# Altium schematic sheet CarrierBoard_TopSheet.SchDoc
size A4; CompanyName: Technische Hochschule Nürnberg Georg Simon Ohm; Organization: UltraZohm; Address1: Kesslerplatz 12; Address2: 90489 Nürnberg; Address3: GERMANY; SheetNumber: 1; Website: www.ultrazohm.com
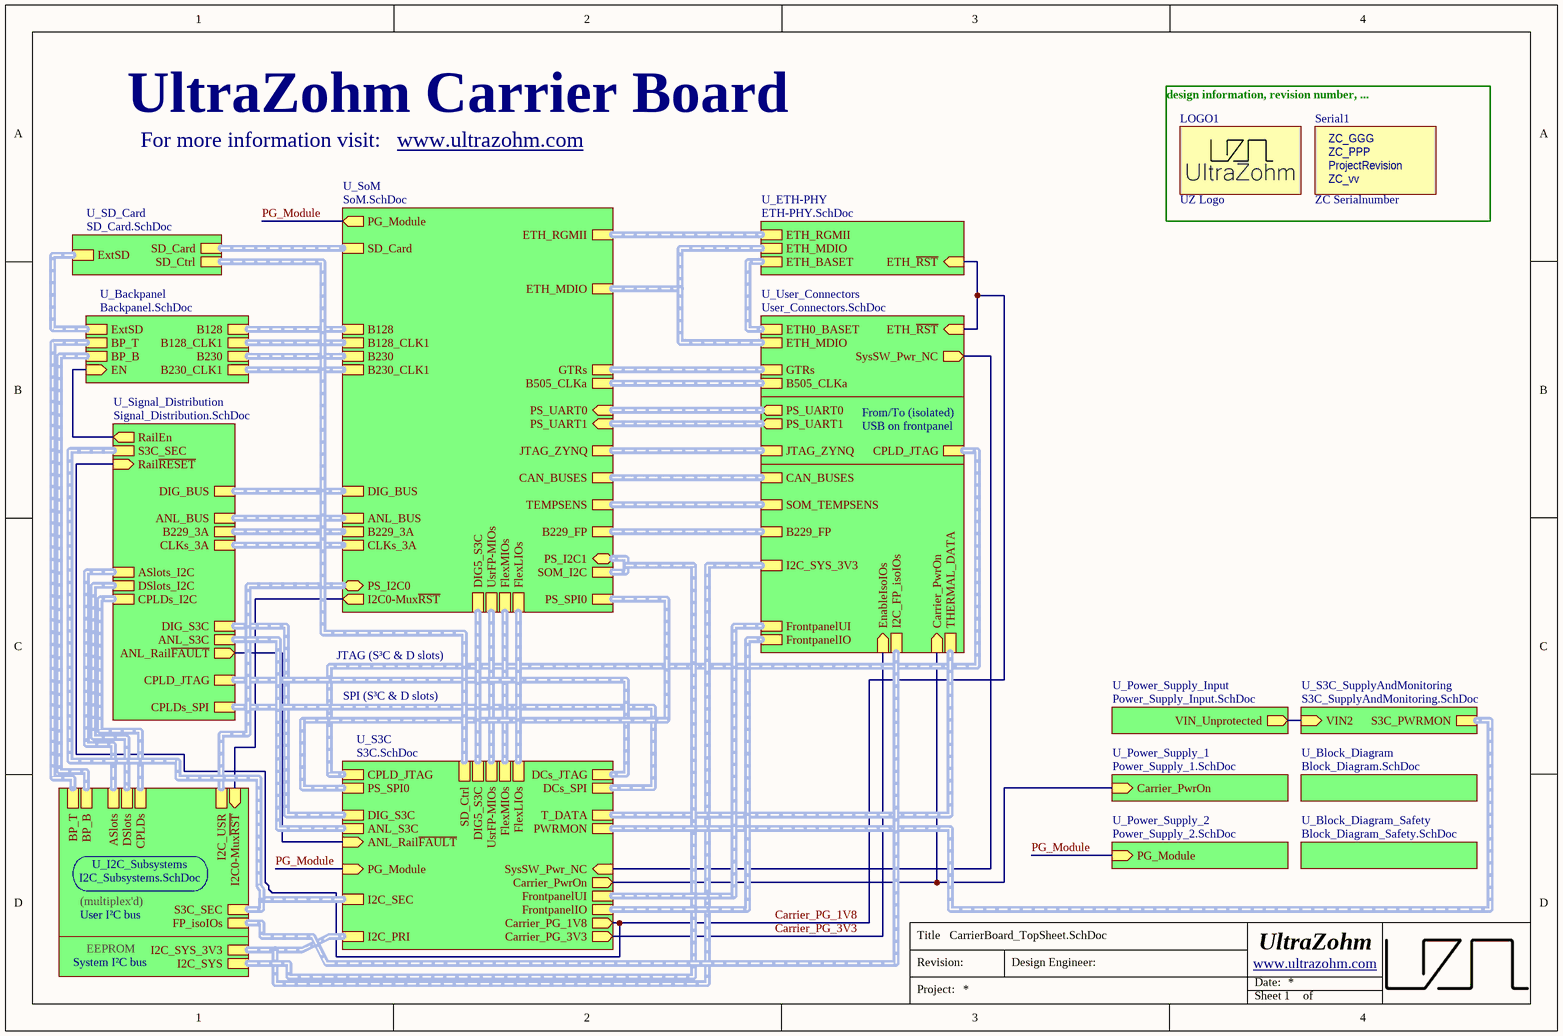
[diagram p0: CarrierBoard_TopSheet.SchDoc]

## Parts
LOGO1  UZ Logo  [UZ_Logo_small]  (no BOM)
Serial1  ZC Serialnumber  [ZC-Serial]  (no BOM)

## Sub-sheets
U_Backpanel = Backpanel.SchDoc: B128 (harness MGT4), B128_CLK1 (harness MGTCLK), B230 (harness MGT4), B230_CLK1 (harness MGTCLK), EN (in), BP_T (harness I2C), BP_B (harness I2C), ExtSD (harness ExtSD)
U_Block_Diagram = Block_Diagram.SchDoc: no entries
U_Block_Diagram_Safety = Block_Diagram_Safety.SchDoc: no entries
U_ETH-PHY = ETH-PHY.SchDoc: ETH_RGMII (harness ETH_RGMII), ETH_MDIO (harness ETH_MDIO), ETH_~{RST} (in), ETH_BASET (harness ETH_BASET)
U_I2C_Subsystems = I2C_Subsystems.SchDoc: I2C_USR (harness I2C), I2C_SYS (harness I2C), I2C_SYS_3V3 (harness I2C), CPLDs (harness I2C), DSlots (harness I2C), ASlots (harness I2C), S3C_SEC (harness I2C), FP_isoIOs (harness I2C), I2C0-Mux~{RST} (in), BP_T (harness I2C), BP_B (harness I2C)
U_Power_Supply_1 = Power_Supply_1.SchDoc: Carrier_PwrOn (in)
U_Power_Supply_2 = Power_Supply_2.SchDoc: PG_Module (in)
U_Power_Supply_Input = Power_Supply_Input.SchDoc: VIN_Unprotected (out)
U_S3C = S3C.SchDoc: DIG_S3C (harness DIG_S3C), PWRMON (harness S3C_PWRMON), CPLD_JTAG (harness JTAG), DCs_JTAG (harness JTAG), DCs_SPI (harness SPI_CPLDs), I2C_PRI (harness I2C), I2C_SEC (harness I2C), FrontpanelUI (harness FrontpanelUI), FlexMIOs (harness FlexMIOs), UsrFP-MIOs (harness UsrFP-MIOs), SysSW_Pwr_NC (in), T_DATA (harness T_DATA), ANL_S3C (harness ANL_S3C), SD_Ctrl (harness SD_Ctrl), PG_Module (in), Carrier_PwrOn (out), FrontpanelIO (harness FrontpanelIO), PS_SPI0 (harness SPI), DIG5_S3C (harness DIG5_S3C), FlexLIOs (harness FlexLIOs), Carrier_PG_3V3 (out), Carrier_PG_1V8 (out), ANL_Rail~{FAULT} (in)
U_S3C_SupplyAndMonitoring = S3C_SupplyAndMonitoring.SchDoc: VIN2 (in), S3C_PWRMON (harness S3C_PWRMON)
U_SD_Card = SD_Card.SchDoc: SD_Card (harness SD_Card), SD_Ctrl (harness SD_Ctrl), ExtSD (harness ExtSD)
U_Signal_Distribution = Signal_Distribution.SchDoc: DIG_BUS (harness DIG_BUS), ANL_BUS (harness ANL_BUS), CPLD_JTAG (harness JTAG), DSlots_I2C (harness I2C), ASlots_I2C (harness I2C), CPLDs_I2C (harness I2C), CPLDs_SPI (harness SPI_CPLDs), DIG_S3C (harness DIG_S3C), ANL_S3C (harness ANL_S3C), ANL_Rail~{FAULT} (out), B229_3A (harness MGT3), CLKs_3A (harness CLKs_3A), RailEn (out), Rail~{RESET} (in), S3C_SEC (harness I2C)
U_SoM = SoM.SchDoc: PS_UART1 (in, harness UART), PS_UART0 (in, harness UART), PS_I2C1 (bidir, harness I2C), PS_I2C0 (bidir, harness I2C), PG_Module (out), DIG_BUS (harness DIG_BUS), ETH_RGMII (harness ETH_RGMII), SD_Card (harness SD_Card), ANL_BUS (harness ANL_BUS), GTRs (harness GTRs), ETH_MDIO (harness ETH_MDIO), JTAG_ZYNQ (harness JTAG), PS_SPI0 (harness SPI), CAN_BUSES (harness CAN_BUSES), SOM_I2C (harness I2C), TEMPSENS (harness T_DIODE), UsrFP-MIOs (harness UsrFP-MIOs), FlexMIOs (harness FlexMIOs), B505_CLKa (harness MGTCLK), DIG5_S3C (harness DIG5_S3C), FlexLIOs (harness FlexLIOs), I2C0-Mux~{RST} (out), B229_3A (harness MGT3), CLKs_3A (harness CLKs_3A), B128 (harness MGT4), B128_CLK1 (harness MGTCLK), B230 (harness MGT4), B230_CLK1 (harness MGTCLK), B229_FP (harness GTH)
U_User_Connectors = User_Connectors.SchDoc: PS_UART0 (out, harness UART), PS_UART1 (out, harness UART), JTAG_ZYNQ (harness JTAG), CAN_BUSES (harness CAN_BUSES), CPLD_JTAG (harness JTAG), GTRs (harness GTRs), ETH0_BASET (harness ETH_BASET), ETH_MDIO (harness ETH_MDIO), SOM_TEMPSENS (harness T_DIODE), I2C_SYS_3V3 (harness I2C), FrontpanelUI (harness FrontpanelUI), SysSW_Pwr_NC (out), B505_CLKa (harness MGTCLK), THERMAL_DATA (harness T_DATA), FrontpanelIO (harness FrontpanelIO), ETH_~{RST} (in), EnableIsoIOs (in), I2C_FP_isoIOs (harness I2C), Carrier_PwrOn (in), B229_FP (harness GTH)

## Nets
Carrier_PG_1V8: sheet U_Signal_Distribution/Rail~{RESET}, sheet U_ETH-PHY/ETH_~{RST}, sheet U_User_Connectors/ETH_~{RST}, sheet U_S3C/Carrier_PG_1V8
Carrier_PG_3V3: sheet U_User_Connectors/EnableIsoIOs, sheet U_S3C/Carrier_PG_3V3
PG_Module: sheet U_SoM/PG_Module, sheet U_Power_Supply_2/PG_Module, sheet U_S3C/PG_Module
(unnamed): sheet U_Signal_Distribution/ANL_Rail~{FAULT}, sheet U_S3C/ANL_Rail~{FAULT}
(unnamed): sheet U_Signal_Distribution/RailEn, sheet U_Backpanel/EN
(unnamed): sheet U_SoM/I2C0-Mux~{RST}, sheet U_I2C_Subsystems/I2C0-Mux~{RST}
(unnamed): sheet U_User_Connectors/SysSW_Pwr_NC, sheet U_S3C/SysSW_Pwr_NC
(unnamed): sheet U_User_Connectors/Carrier_PwrOn, sheet U_Power_Supply_1/Carrier_PwrOn, sheet U_S3C/Carrier_PwrOn
(unnamed): sheet U_Power_Supply_Input/VIN_Unprotected, sheet U_S3C_SupplyAndMonitoring/VIN2

## Buses and harness runs
harness sheet U_Backpanel/B128 = sheet U_SoM/B128
harness sheet U_Backpanel/B128_CLK1 = sheet U_SoM/B128_CLK1
harness sheet U_Backpanel/B230 = sheet U_SoM/B230
harness sheet U_Backpanel/B230_CLK1 = sheet U_SoM/B230_CLK1
harness sheet U_Backpanel/BP_B = sheet U_I2C_Subsystems/BP_B
harness sheet U_Backpanel/BP_T = sheet U_I2C_Subsystems/BP_T
harness sheet U_Backpanel/ExtSD = sheet U_SD_Card/ExtSD
harness sheet U_ETH-PHY/ETH_BASET = sheet U_User_Connectors/ETH0_BASET
harness sheet U_ETH-PHY/ETH_MDIO = sheet U_SoM/ETH_MDIO = sheet U_User_Connectors/ETH_MDIO
harness sheet U_ETH-PHY/ETH_RGMII = sheet U_SoM/ETH_RGMII
harness sheet U_I2C_Subsystems/ASlots = sheet U_Signal_Distribution/ASlots_I2C
harness sheet U_I2C_Subsystems/CPLDs = sheet U_Signal_Distribution/CPLDs_I2C
harness sheet U_I2C_Subsystems/DSlots = sheet U_Signal_Distribution/DSlots_I2C
harness sheet U_I2C_Subsystems/FP_isoIOs = sheet U_User_Connectors/I2C_FP_isoIOs
harness sheet U_I2C_Subsystems/I2C_SYS = sheet U_SoM/PS_I2C1 = sheet U_SoM/SOM_I2C
harness sheet U_I2C_Subsystems/I2C_SYS_3V3 = sheet U_S3C/I2C_PRI = sheet U_User_Connectors/I2C_SYS_3V3
harness sheet U_I2C_Subsystems/I2C_USR = sheet U_SoM/PS_I2C0
harness sheet U_I2C_Subsystems/S3C_SEC = sheet U_S3C/I2C_SEC = sheet U_Signal_Distribution/S3C_SEC
harness sheet U_S3C/ANL_S3C = sheet U_Signal_Distribution/ANL_S3C
harness sheet U_S3C/CPLD_JTAG = sheet U_User_Connectors/CPLD_JTAG
harness sheet U_S3C/DCs_JTAG = sheet U_Signal_Distribution/CPLD_JTAG
harness sheet U_S3C/DCs_SPI = sheet U_Signal_Distribution/CPLDs_SPI
harness sheet U_S3C/DIG5_S3C = sheet U_SoM/DIG5_S3C
harness sheet U_S3C/DIG_S3C = sheet U_Signal_Distribution/DIG_S3C
harness sheet U_S3C/FlexLIOs = sheet U_SoM/FlexLIOs
harness sheet U_S3C/FlexMIOs = sheet U_SoM/FlexMIOs
harness sheet U_S3C/FrontpanelIO = sheet U_User_Connectors/FrontpanelIO
harness sheet U_S3C/FrontpanelUI = sheet U_User_Connectors/FrontpanelUI
harness sheet U_S3C/PS_SPI0 = sheet U_SoM/PS_SPI0
harness sheet U_S3C/PWRMON = sheet U_S3C_SupplyAndMonitoring/S3C_PWRMON
harness sheet U_S3C/SD_Ctrl = sheet U_SD_Card/SD_Ctrl
harness sheet U_S3C/T_DATA = sheet U_User_Connectors/THERMAL_DATA
harness sheet U_S3C/UsrFP-MIOs = sheet U_SoM/UsrFP-MIOs
harness sheet U_SD_Card/SD_Card = sheet U_SoM/SD_Card
harness sheet U_Signal_Distribution/ANL_BUS = sheet U_SoM/ANL_BUS
harness sheet U_Signal_Distribution/B229_3A = sheet U_SoM/B229_3A
harness sheet U_Signal_Distribution/CLKs_3A = sheet U_SoM/CLKs_3A
harness sheet U_Signal_Distribution/DIG_BUS = sheet U_SoM/DIG_BUS
harness sheet U_SoM/B229_FP = sheet U_User_Connectors/B229_FP
harness sheet U_SoM/B505_CLKa = sheet U_User_Connectors/B505_CLKa
harness sheet U_SoM/CAN_BUSES = sheet U_User_Connectors/CAN_BUSES
harness sheet U_SoM/GTRs = sheet U_User_Connectors/GTRs
harness sheet U_SoM/JTAG_ZYNQ = sheet U_User_Connectors/JTAG_ZYNQ
harness sheet U_SoM/PS_UART0 = sheet U_User_Connectors/PS_UART0
harness sheet U_SoM/PS_UART1 = sheet U_User_Connectors/PS_UART1
harness sheet U_SoM/TEMPSENS = sheet U_User_Connectors/SOM_TEMPSENS

## Notes on the sheet
- UltraZohm Carrier Board
- For more information visit:
- www.ultrazohm.com <https://www.ultrazohm.com>
- (near Serial1) design information, revision number, ...
- From/To (isolated)
- USB on frontpanel
- JTAG (S³C & D slots)
- SPI (S³C & D slots)
- (multiplex'd)
- User I²C bus
- System I²C bus
- EEPROM
- Title
- Revision:
- Design Engineer:
- Date:
- Project:
- Sheet
- of
- (in symbol ZC-Serial) ZC_GGG; ZC_PPP; ProjectRevision; ZC_vv

## Library data of the parts
LOGO1 = UZ Logo: UltraZohm Logo on PCB; Created: Jan2021_Liegmann; Value: UZ Logo
Serial1 = ZC-Serial: Manufacturer: UltraZohm; Value: GGG-PPP-VVvv; Created from: FRosner; Manufacturer Part Number: ZC-Serial; PartID: 58; Created On: 15/04/2025 09:17:14; ComponentLink1Description: https://docs.ultrazohm.com/; ComponentLink1URL: homepage; Component Type: ZC Serialnumber; Last Updated: 15/04/2025 09:17:14; Supplier 1: -; Supplier Part Number 1: -; Type: Serial Number; Live Cycle Status: 1